# Altium schematic sheet Connector.SchDoc: Connector
size A4; Author: DODANHLUONG; Revision: 1.0; SheetNumber: 5; SheetTotal: 6; ProjectTitle: KIT ARDUINO VERSION 1.0
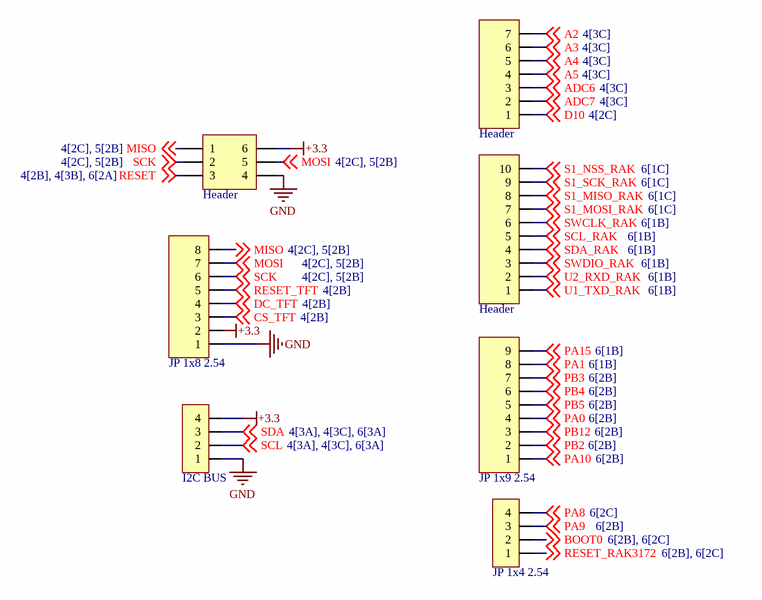
[diagram p0: Connector.SchDoc]

## Parts
JP1  Header  [JP 1x7 CT]
JP2  Header  [JP 2x3 DT]
JP3  Header  [JP 1x10 CT]
JP4  JP 1x8 2.54  [JP 1x8 CT]
JP5  JP 1x9 2.54  [JP 1x9 CT]
JP6  I2C BUS  [JP 1x4 CT]
JP7  JP 1x4 2.54  [JP 1x4 CT]

## Nets
+3.3: JP2.6 JP4.2 JP6.4
GND: JP2.4 JP4.1 JP6.1
A2: JP1.7 ; off-sheet A2
A3: JP1.6 ; off-sheet A3
A4: JP1.5 ; off-sheet A4
A5: JP1.4 ; off-sheet A5
ADC6: JP1.3 ; off-sheet ADC6
ADC7: JP1.2 ; off-sheet ADC7
BOOT0: JP7.2 ; off-sheet BOOT0
CS_TFT: JP4.3 ; off-sheet CS_TFT
D10: JP1.1 ; off-sheet D10
DC_TFT: JP4.4 ; off-sheet DC_TFT
MISO: JP2.1 JP4.8 ; off-sheet MISO
MOSI: JP2.5 JP4.7 ; off-sheet MOSI
PA0: JP5.4 ; off-sheet PA0
PA1: JP5.8 ; off-sheet PA1
PA8: JP7.4 ; off-sheet PA8
PA9: JP7.3 ; off-sheet PA9
PA10: JP5.1 ; off-sheet PA10
PA15: JP5.9 ; off-sheet PA15
PB2: JP5.2 ; off-sheet PB2
PB3: JP5.7 ; off-sheet PB3
PB4: JP5.6 ; off-sheet PB4
PB5: JP5.5 ; off-sheet PB5
PB12: JP5.3 ; off-sheet PB12
RESET: JP2.3 ; off-sheet RESET
RESET_RAK3172: JP7.1 ; off-sheet RESET_RAK3172
RESET_TFT: JP4.5 ; off-sheet RESET_TFT
S1_MISO_RAK: JP3.8 ; off-sheet S1_MISO_RAK
S1_MOSI_RAK: JP3.7 ; off-sheet S1_MOSI_RAK
S1_NSS_RAK: JP3.10 ; off-sheet S1_NSS_RAK
S1_SCK_RAK: JP3.9 ; off-sheet S1_SCK_RAK
SCK: JP2.2 JP4.6 ; off-sheet SCK
SCL: JP6.2 ; off-sheet SCL
SCL_RAK: JP3.5 ; off-sheet SCL_RAK
SDA: JP6.3 ; off-sheet SDA
SDA_RAK: JP3.4 ; off-sheet SDA_RAK
SWCLK_RAK: JP3.6 ; off-sheet SWCLK_RAK
SWDIO_RAK: JP3.3 ; off-sheet SWDIO_RAK
U1_TXD_RAK: JP3.1 ; off-sheet U1_TXD_RAK
U2_RXD_RAK: JP3.2 ; off-sheet U2_RXD_RAK

## Notes on the sheet
- Author:
- Title:
- Size:
- A4
- Project:
- Approved:
- Revision:
- Modified Date:
- CONFIDENTIAL
- Date:
- SW Version:

## Library data of the parts
JP1 = JP 1x7 2.54 Cai Thang: Cắm; Ten_Linh_Kien: Jump Đơn Cái 2.54MM 1x20P Thẳng; Don_Vi: Con; Ma_Hang: MH004006; Ghi_Chu: *; Kieu_Chan: *; Chung_Loai: Cắm
JP2 = JP 2x3 2.54 Duc Thang: Cắm; Ten_Linh_Kien: Jump Đôi Đực 2.54MM 2x40P Thẳng 11MM; Don_Vi: Con; Ma_Hang: MH002686; Ghi_Chu: *; Kieu_Chan: *; Chung_Loai: Cắm
JP3 = JP 1x10 2.54 Cai Thang: Cắm; Ten_Linh_Kien: Jump Đơn Cái 2.54MM 1x20P Thẳng; Don_Vi: Con; Ma_Hang: MH004006; Ghi_Chu: *; Kieu_Chan: *; Chung_Loai: Cắm
JP4 = JP 1x8 2.54 Cai Thang: Cắm; Ten_Linh_Kien: Jump Đơn Cái 2.54MM 1x20P Thẳng; Don_Vi: Con; Ma_Hang: MH004006; Ghi_Chu: *; Kieu_Chan: *; Chung_Loai: Cắm
JP5 = JP 1x9 2.54 Cai Thang: Cắm; Ten_Linh_Kien: Jump Đơn Cái 2.54MM 1x20P Thẳng; Don_Vi: Con; Ma_Hang: MH004006; Ghi_Chu: *; Kieu_Chan: *; Chung_Loai: Cắm
JP6 JP7 = JP 1x4 2.54 Cai Thang: Cắm; Ten_Linh_Kien: Jump Đơn Cái 2.54MM 1x20P Thẳng; Don_Vi: Con; Ma_Hang: MH004006; Ghi_Chu: *; Kieu_Chan: *; Chung_Loai: Cắm